# EAGLE design Newtech Music Board (EAGLE 9.6.2)

## Sheet 1 of 3
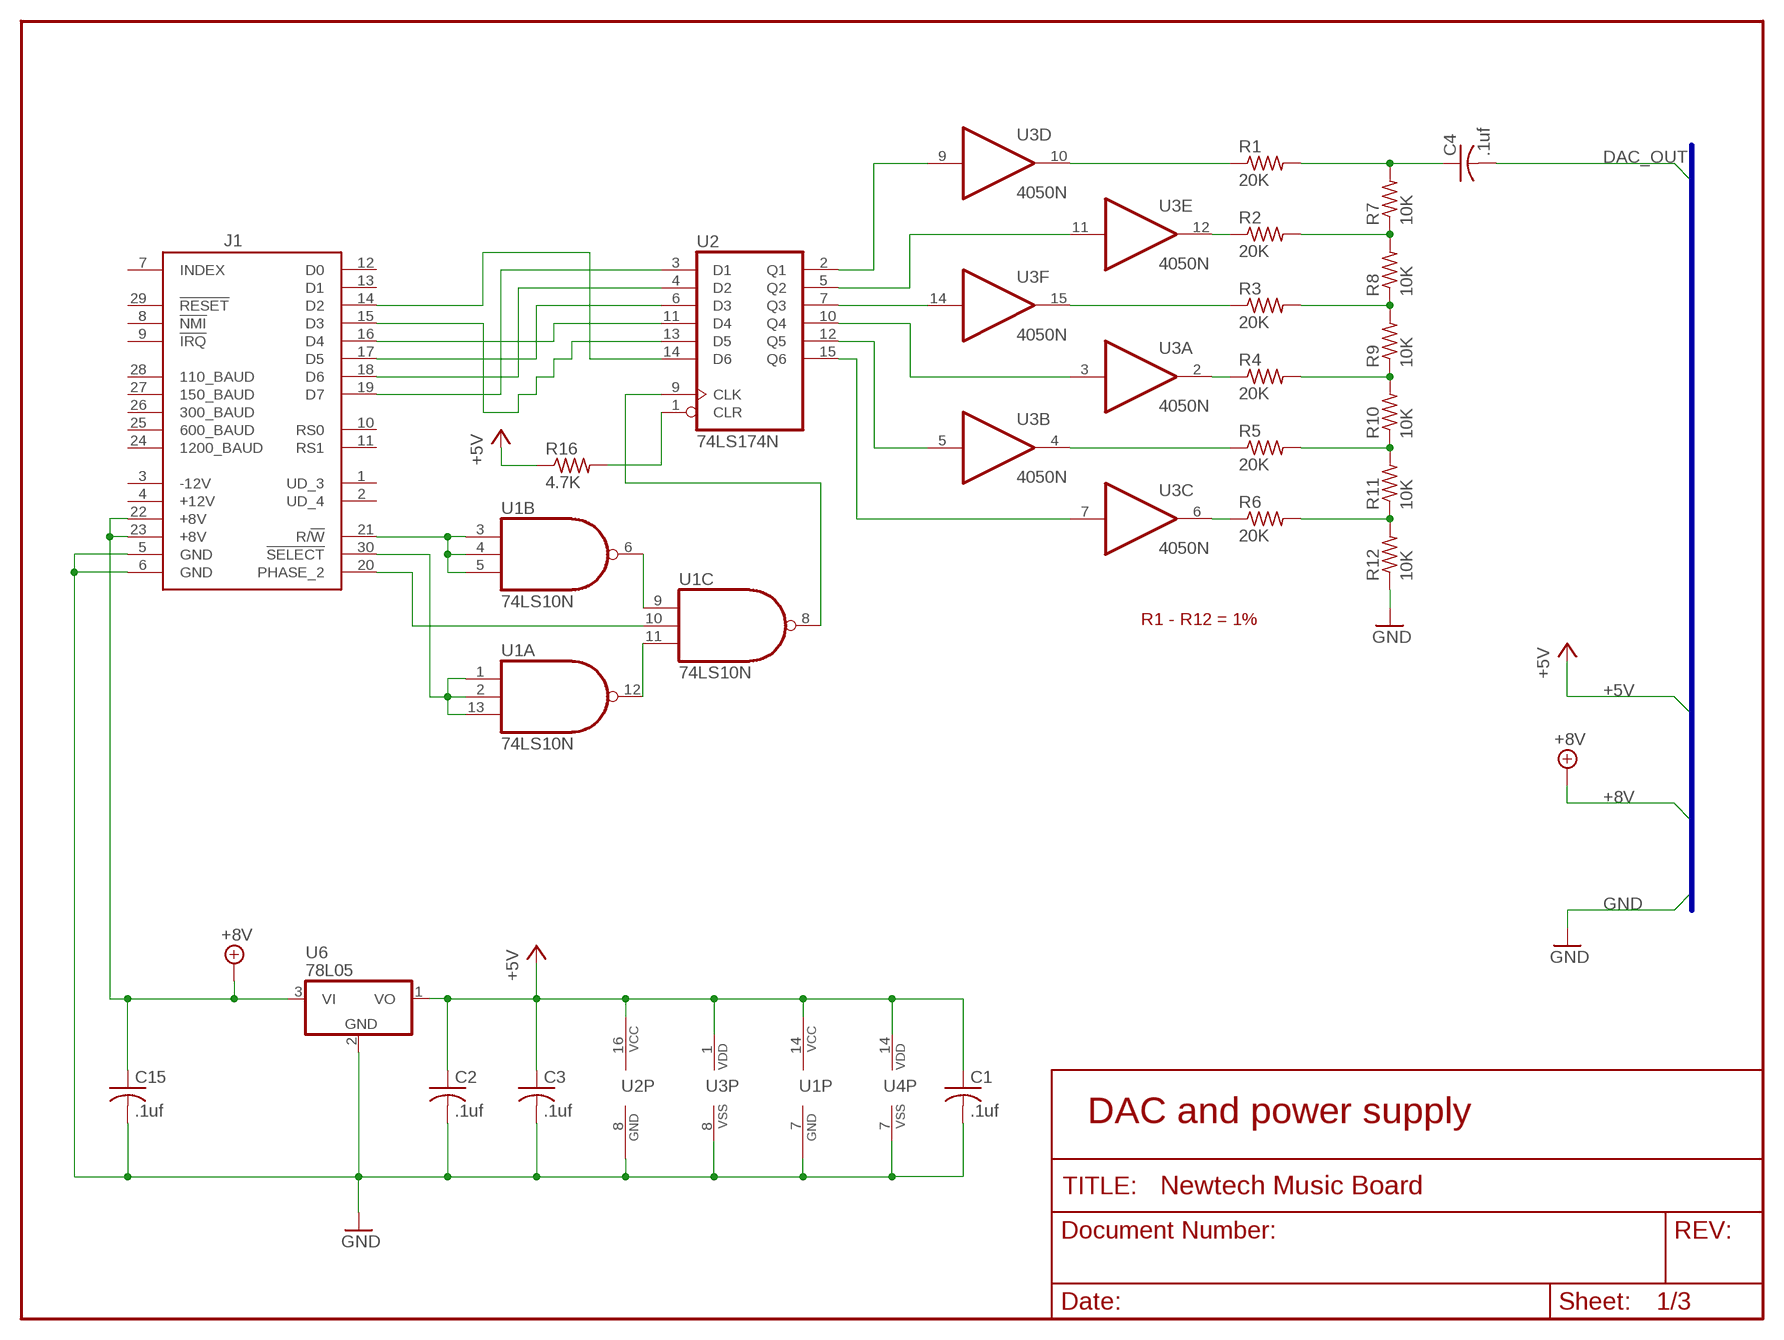
[diagram p0: schematic, sheet 1]

### Parts
C1  .1uf  C-US025-025X050  [C025-025X050]
C2  .1uf  C-US025-025X050  [C025-025X050]
C3  .1uf  C-US025-025X050  [C025-025X050]
C4  .1uf  C-US025-024X044  [C025-024X044]
C15  .1uf  C-US025-025X050  [C025-025X050]
J1  SS-30_BOARD_CONNECTOR  [SS-30_BOARD_CONNECTOR]
R1  20K  R-US_0204/7  [0204/7]
R2  20K  R-US_0204/7  [0204/7]
R3  20K  R-US_0204/7  [0204/7]
R4  20K  R-US_0204/7  [0204/7]
R5  20K  R-US_0204/7  [0204/7]
R6  20K  R-US_0204/7  [0204/7]
R7  10K  R-US_0204/7  [0204/7]
R8  10K  R-US_0204/7  [0204/7]
R9  10K  R-US_0204/7  [0204/7]
R10  10K  R-US_0204/7  [0204/7]
R11  10K  R-US_0204/7  [0204/7]
R12  10K  R-US_0204/7  [0204/7]
R16  4.7K  R-US_0204/7  [0204/7]
U1  74LS10N  [DIL14]
U2  74LS174N  [DIL16]
U3  4050N  [DIL16]
U4  4069N  [DIL14]
U6  78L05  78L05ACZ  [TO-92]

### Nets
!SELECT: J1.30(!SELECT) U1.1(A:I0) U1.2(A:I1) U1.13(A:I2)
+5V: C1.1 C2.1 C3.1 R16.1 U1.14(P:VCC) U2.16(VCC) U3.1(P:VDD) U4.14(P:VDD) U6.1(VO) ; also sheet 3
+8V [POWER]: C15.1 J1.22(+8V) J1.23(+8V) U6.3(VI) ; also sheet 3
DAC_OUT: C4.2 ; also sheet 2
GND [POWER]: C1.2 C2.2 C3.2 C15.2 J1.5(GND) J1.6(GND) R12.1 U1.7(P:GND) U2.8(GND) U3.8(P:VSS) U4.7(P:VSS) U6.2(GND) ; also sheet 3
N$1: J1.19(D7) U2.3(D1)
N$2: J1.18(D6) U2.4(D2)
N$3: J1.17(D5) U2.6(D3)
N$4: U1.6(B:O) U1.9(C:I0)
N$5: U1.11(C:I2) U1.12(A:O)
N$6: J1.16(D4) U2.11(D4)
N$7: J1.15(D3) U2.13(D5)
N$8: J1.14(D2) U2.14(D6)
N$9: U2.2(Q1) U3.9(D:I)
N$10: U2.5(Q2) U3.11(E:I)
N$11: U2.7(Q3) U3.14(F:I)
N$12: U2.10(Q4) U3.3(A:I)
N$13: U2.12(Q5) U3.5(B:I)
N$14: U2.15(Q6) U3.7(C:I)
N$16: U1.8(C:O) U2.9(CLK)
N$17: R16.2 U2.1(CLR)
N$18: R1.1 U3.10(D:O)
N$19: R2.1 U3.12(E:O)
N$20: R3.1 U3.15(F:O)
N$21: R4.1 U3.2(A:O)
N$22: R5.1 U3.4(B:O)
N$23: R6.1 U3.6(C:O)
N$24: R2.2 R7.1 R8.2
N$25: R3.2 R8.1 R9.2
N$26: R4.2 R9.1 R10.2
N$27: R5.2 R10.1 R11.2
N$28: R6.2 R11.1 R12.2
N$29: C4.1 R1.2 R7.2
PHASE2: J1.20(PHASE_2) U1.10(C:I1)
R/!W: J1.21(R/!W) U1.3(B:I0) U1.4(B:I1) U1.5(B:I2)
Unconnected: J1.1(UD_3) J1.2(UD_4) J1.7(INDEX) J1.8(!NMI) J1.9(!IRQ) J1.10(RS0) J1.11(RS1) J1.12(D0) J1.13(D1) J1.24(1200_BAUD) J1.25(600_BAUD) J1.26(300_BAUD) J1.27(150_BAUD) J1.28(110_BAUD) J1.29(!RESET)

### Buses
+5V,+8V,GND,DAC_OUT,LPF_OUT

### Notes on the sheet
- R1 - R12 = 1%
- DAC and power supply

## Sheet 2 of 3
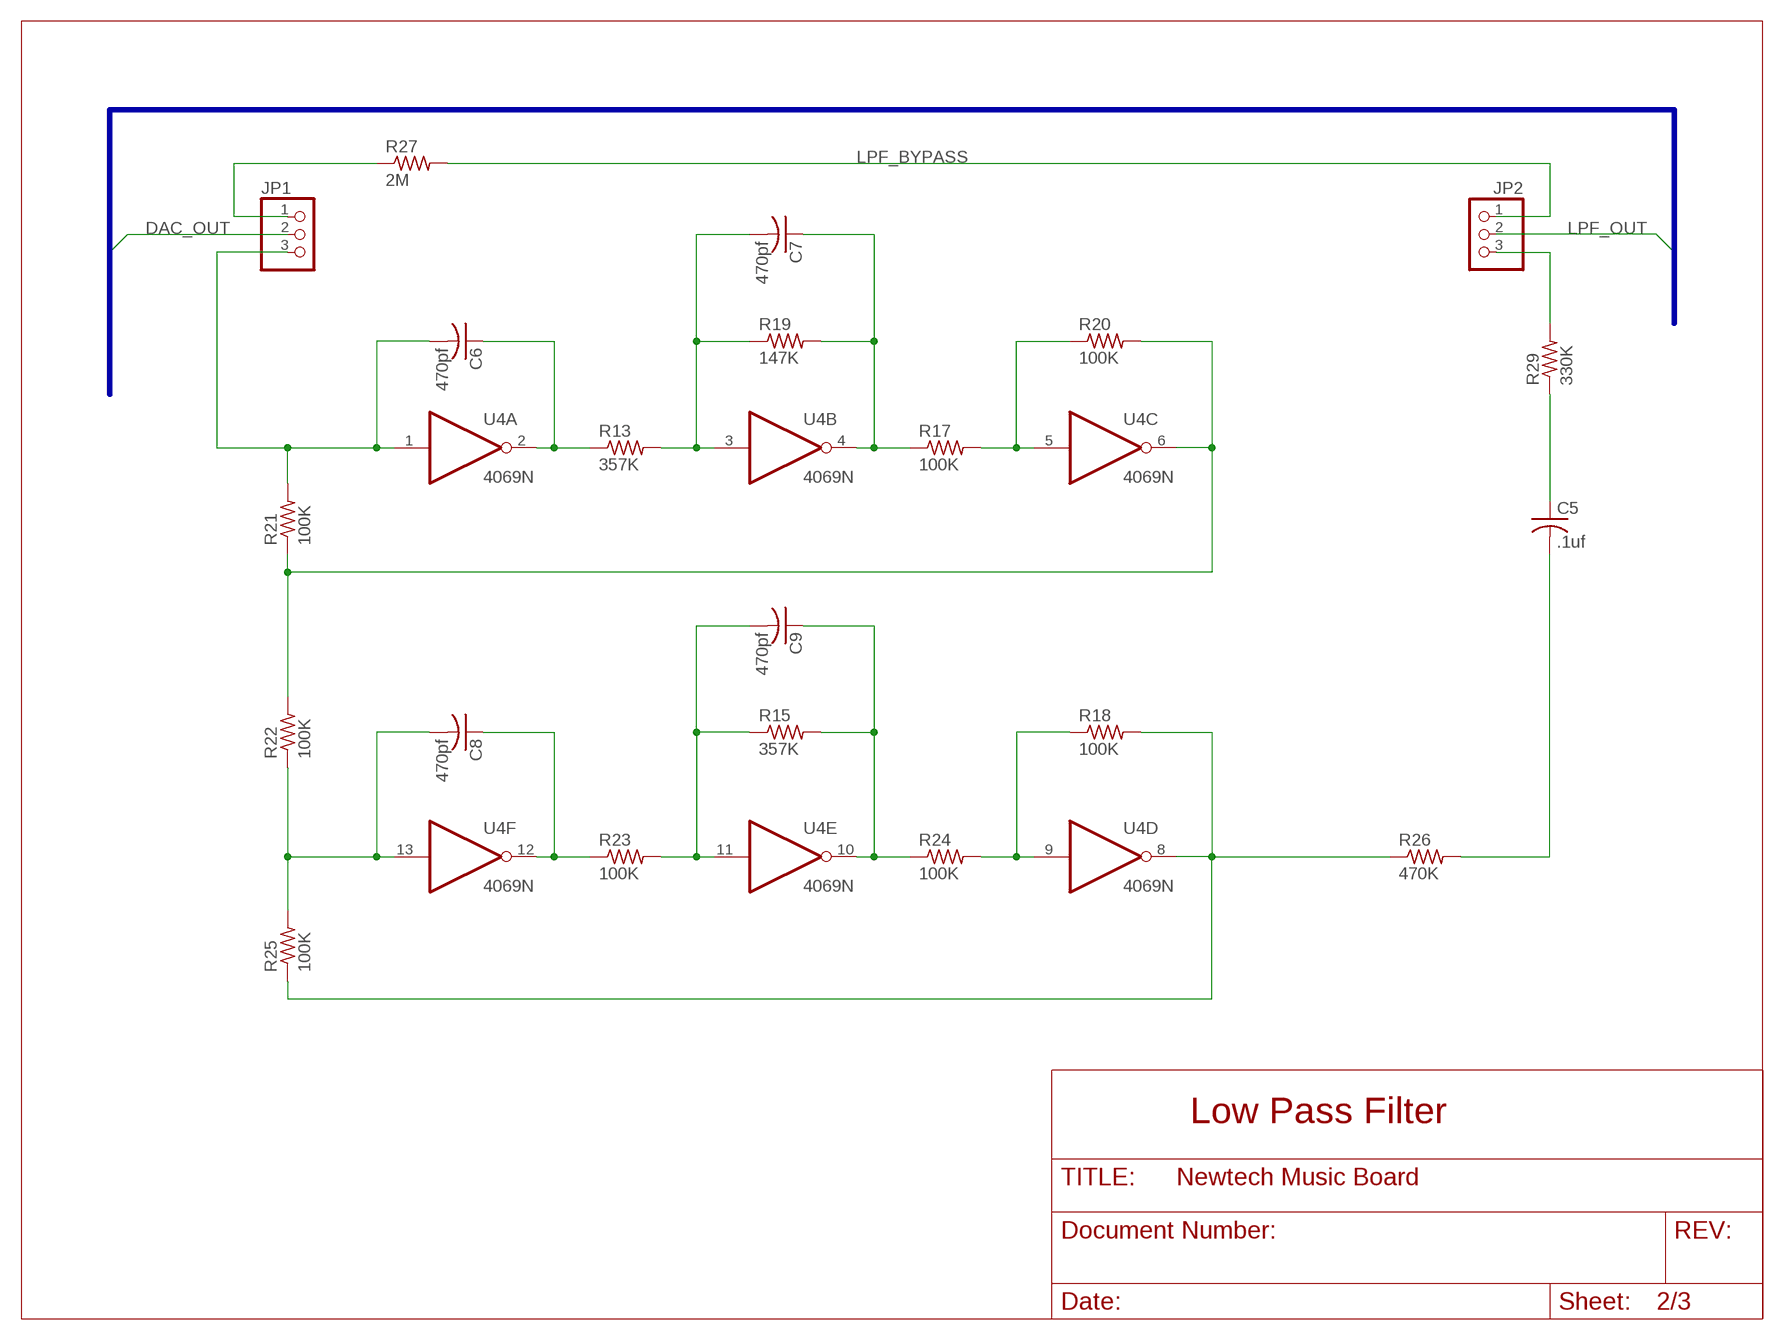
[diagram p1: schematic, sheet 2]

### Parts
C5  .1uf  C-US025-025X050  [C025-025X050]
C6  470pf  C-US050-045X075  [C050-045X075]
C7  470pf  C-US050-045X075  [C050-045X075]
C8  470pf  C-US050-045X075  [C050-045X075]
C9  470pf  C-US050-045X075  [C050-045X075]
JP1  PINHD-1X3  [1X03]
JP2  PINHD-1X3  [1X03]
R13  357K  R-US_0204/7  [0204/7]
R15  357K  R-US_0204/7  [0204/7]
R17  100K  R-US_0204/7  [0204/7]
R18  100K  R-US_0204/7  [0204/7]
R19  147K  R-US_0204/7  [0204/7]
R20  100K  R-US_0204/7  [0204/7]
R21  100K  R-US_0204/7  [0204/7]
R22  100K  R-US_0204/7  [0204/7]
R23  100K  R-US_0204/7  [0204/7]
R24  100K  R-US_0204/7  [0204/7]
R25  100K  R-US_0204/7  [0204/7]
R26  470K  R-US_0204/7  [0204/7]
R27  2M  R-US_0204/7  [0204/7]
R29  330K  R-US_0204/7  [0204/7]

### Nets
DAC_OUT: JP1.2 ; also sheet 1
LPF_BYPASS: JP2.1 R27.2
LPF_OUT: JP2.2 ; also sheet 3
N$31: C6.2 JP1.3 R21.2 U4.1(A:I)
N$32: JP2.3 R29.2
N$33: C6.1 R13.1 U4.2(A:O)
N$34: C7.2 R13.2 R19.1 U4.3(B:I)
N$35: C7.1 R17.1 R19.2 U4.4(B:O)
N$37: R17.2 R20.1 U4.5(C:I)
N$38: R20.2 R21.1 R22.2 U4.6(C:O)
N$39: JP1.1 R27.1
N$40: C8.1 R23.1 U4.12(F:O)
N$41: C9.2 R15.1 R23.2 U4.11(E:I)
N$42: C9.1 R15.2 R24.1 U4.10(E:O)
N$43: R18.1 R24.2 U4.9(D:I)
N$45: R18.2 R25.1 R26.1 U4.8(D:O)
N$49: C5.2 R26.2
N$51: C5.1 R29.1
N$56: C8.2 R22.1 R25.2 U4.13(F:I)

### Buses
+5V,+8V,GND,DAC_OUT,LPF_OUT

### Notes on the sheet
- Low Pass Filter

## Sheet 3 of 3
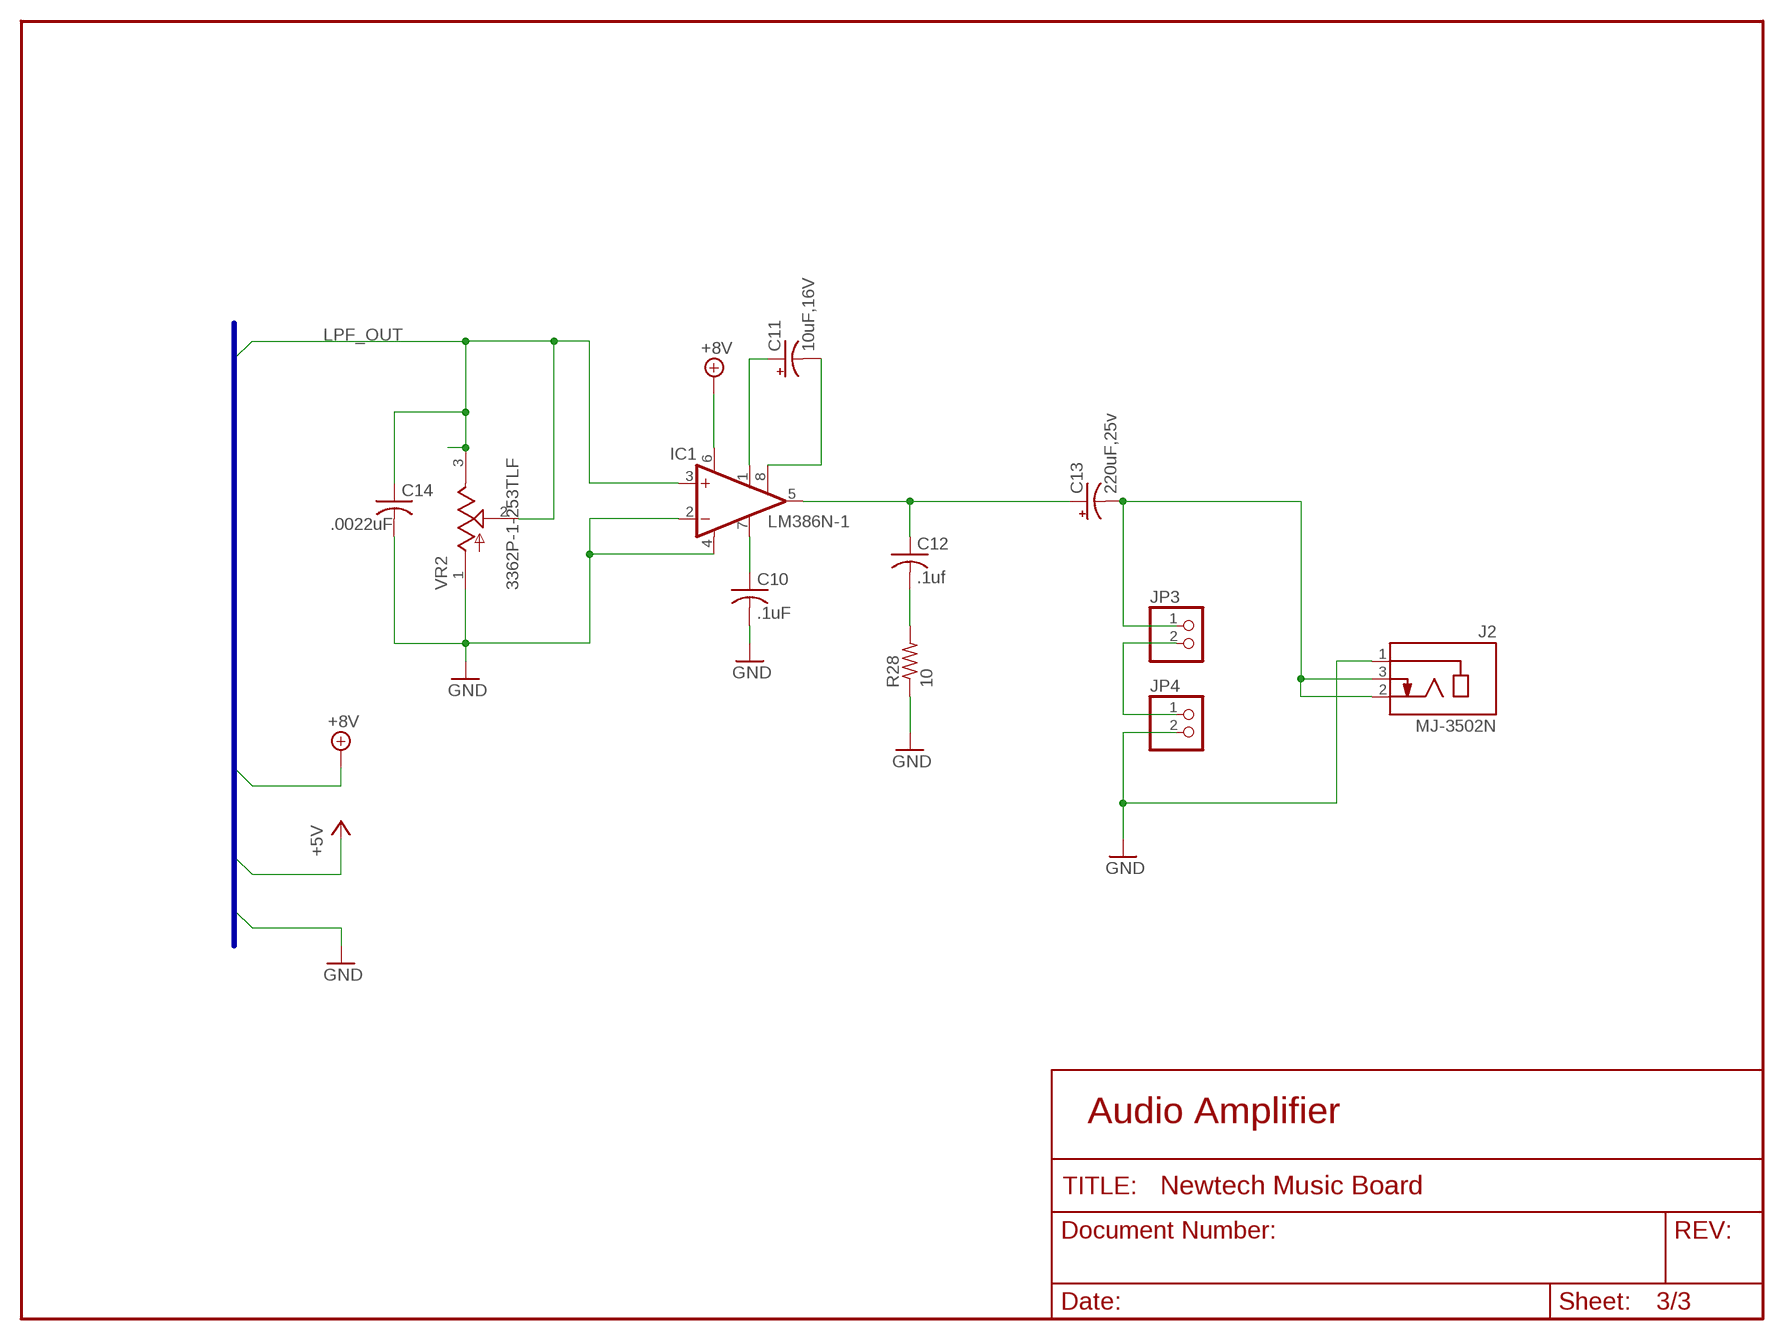
[diagram p2: schematic, sheet 3]

### Parts
C10  .1uF  C-US025-025X050  [C025-025X050]
C11  10uF,16V  CPOL-USE2.5-6  [E2,5-6]
C12  .1uf  C-US025-025X050  [C025-025X050]
C13  220uF,25v  CPOL-USE25-9AXIAL  [E25-9]
C14  .0022uF  C-US025-025X050  [C025-025X050]
IC1  LM386N-1  [DIL08]
J2  MJ-3502N  [CUI_MJ-3502N]
JP3  PINHD-1X2  [1X02]
JP4  PINHD-1X2  [1X02]
R28  10  R-US_0204/7  [0204/7]
VR2  3362P-1-253TLF  [TRIM_3362P-1-253TLF]

### Nets
+8V [POWER]: IC1.6(VS) ; also sheet 1
GND [POWER]: C10.2 C14.2 IC1.2(-IN) IC1.4(GND) J2.1 JP4.2 R28.1 VR2.1(CCW) ; also sheet 1
LPF_OUT: C14.1 IC1.3(+IN) VR2.2(WIPER) VR2.3(CW) ; also sheet 2
N$15 [Audio]: JP3.2 JP4.1
N$30: C10.1 IC1.7(BYPASS)
N$36: C12.2 R28.2
N$46: C11.+ IC1.1(GAIN)
N$47 [Audio]: C12.1 C13.+ IC1.5(OUT)
N$48 [Audio]: C13.- J2.2 J2.3 JP3.1
N$50: C11.- IC1.8(GAIN)

### Buses
+5V,+8V,GND,DAC_OUT,LPF_OUT

### Notes on the sheet
- Audio Amplifier

## Power pins joined to a net without a drawn wire
+12V: J1.4(+12V)
-12V: J1.3(-12V)

## Library data of the parts
C1-C9 C12 C14 C15 = rcl:C-US: CAPACITOR, American symbol
C10 = rcl:C-US: CAPACITOR, American symbol; SPICEPREFIX: C
C11 C13 = rcl:CPOL-US: POLARIZED CAPACITOR, American symbol; SPICEPREFIX: C
IC1 = linear:LM386?-*: Low Voltage Audio Power Amplifier Source: http://cache.national.com/ds/LM/LM386.pdf
J1 = Bob:SS-30_BOARD_CONNECTOR
J2 = MJ-3502N:MJ-3502N: 3.5 mm, Mono, Right Angle, Through Hole, Audio Jack Connector Check availability <https://pricing.snapeda.com/parts/MJ-3502N/CUI%20Devices/view-part?ref=eda>; AVAILABILITY: In Stock; CHECK_PRICES: https://www.snapeda.com/parts/MJ-3502N/CUI+Devices/view-part/?ref=eda; CUI_PURCHASE_URL: https://www.cuidevices.com/product/interconnect/connectors/audio-connectors/jacks/mj-3502n?utm_source=snapeda.com&utm_medium=referral&utm_campaign=snapedaBOM; DESCRIPTION: 3.5 mm, Mono, Right Angle, Through Hole, 2 Conductors, 1 Internal Switch, Audio Jack Connector; MF: CUI Devices; MP: MJ-3502N; PACKAGE: None; PRICE: None; PURCHASE-URL: https://www.snapeda.com/api/url_track_click_mouser/?unipart_id=542465&manufacturer=CUI Devices&part_name=MJ-3502N&search_term=audio 3.5 jack mono; SNAPEDA_LINK: https://www.snapeda.com/parts/MJ-3502N/CUI+Devices/view-part/?ref=snap
JP1 JP2 = pinhead:PINHD-1X3: PIN HEADER
JP3 JP4 = pinhead:PINHD-1X2: PIN HEADER
R1-R13 R15-R27 R29 = rcl:R-US_: RESISTOR, American symbol
R28 = rcl:R-US_: RESISTOR, American symbol; SPICEPREFIX: R
U1 = 74xx-us:74*10: Triple 3-input NAND gate
U2 = 74xx-us:74*174: Hex D type FLIP FLOP, clear
U3 = 40xx:4050: Hex non-inverting BUFFER
U4 = 40xx:4069: Hex INVERTER
U6 = 78L05ACZ:78L05ACZ: Check availability <https://pricing.snapeda.com/parts/78L05ACZ/STMicroelectronics/view-part?ref=eda>; AVAILABILITY: Not in stock; CHECK_PRICES: https://www.snapeda.com/parts/78L05ACZ/STMicroelectronics/view-part/?ref=eda; DESCRIPTION: Linear Voltage Regulator IC Positive Fixed 1 Output 100mA TO-92-3; MF: STMicroelectronics; MP: 78L05ACZ; PACKAGE: TO-92 STMicroelectronics; PRICE: None; SNAPEDA_LINK: https://www.snapeda.com/parts/78L05ACZ/STMicroelectronics/view-part/?ref=snap
VR2 = 3362P-1-253TLF:3362P-1-253TLF: Res Cermet Trimmer 50K Ohm 10% 1/2W 1(Elec)/1(Mech)Turn 2.77mm (6.6 X 6.99 X 4.7mm) Pin Thru-Hole Tube; MF: Bourns; MP: 3362P-1-205LF; PARTREV: 08/26/10; STANDARD: Manufacturer Recommendation

## Net classes
1 POWER: width 0.406 mm
2 Audio: width 0.762 mm

## Board
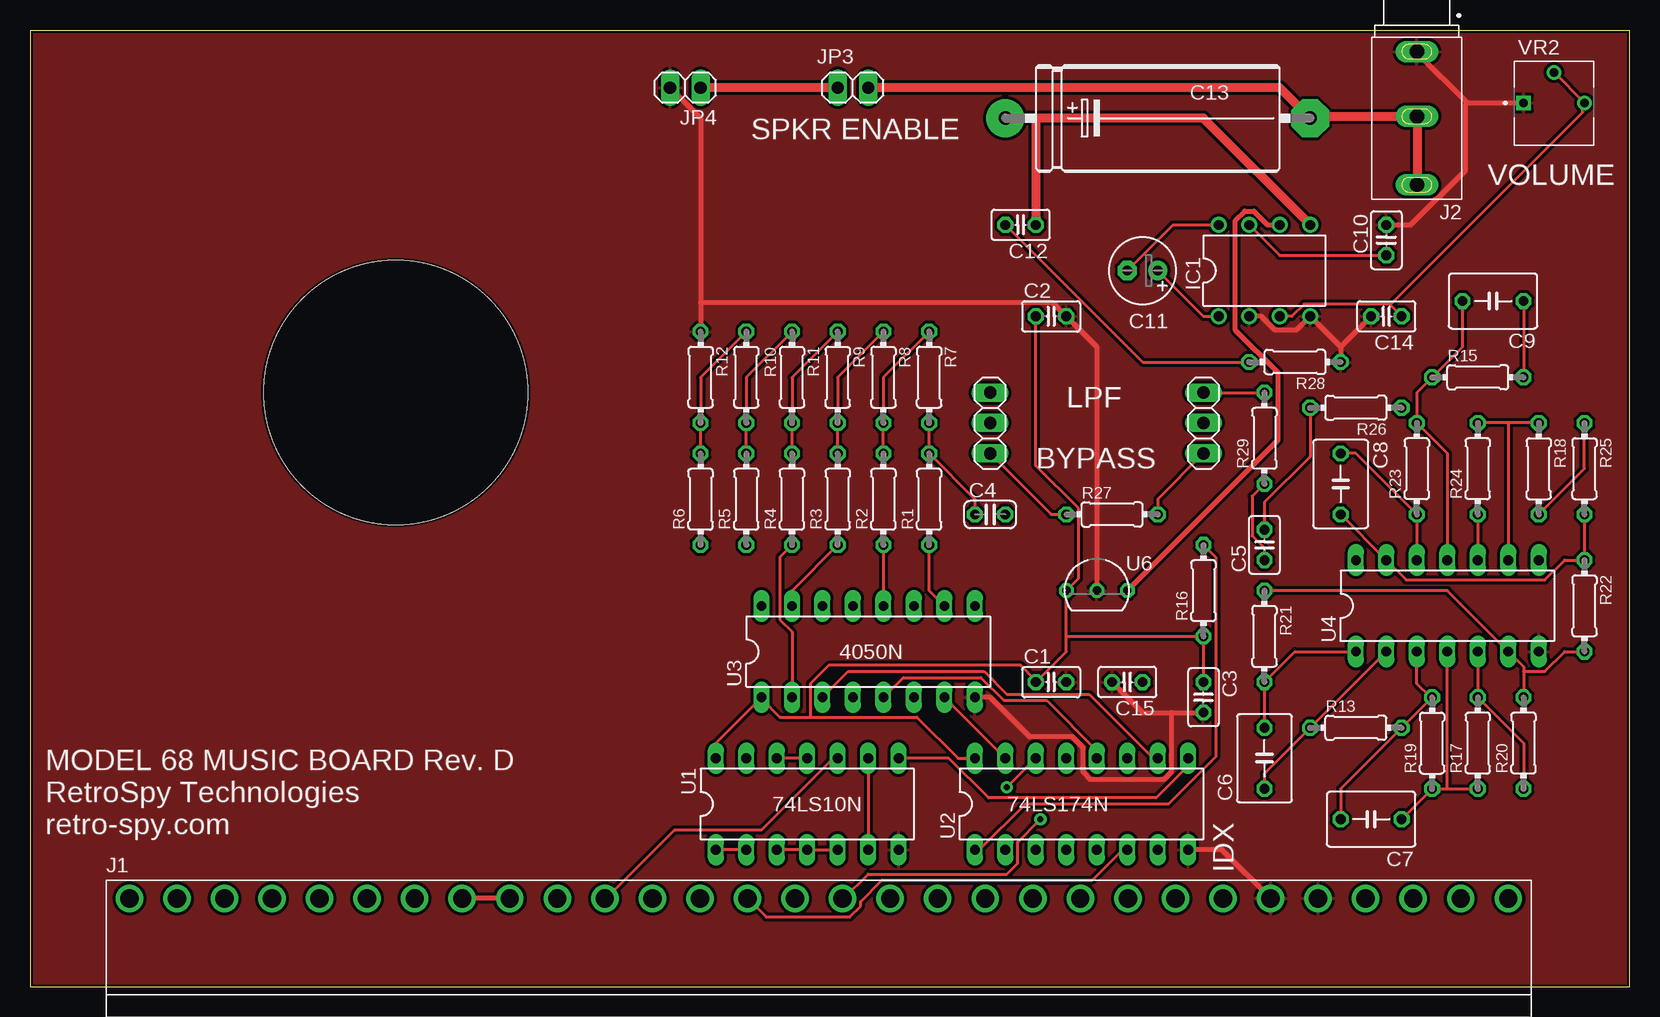
[diagram p3: board, top side]
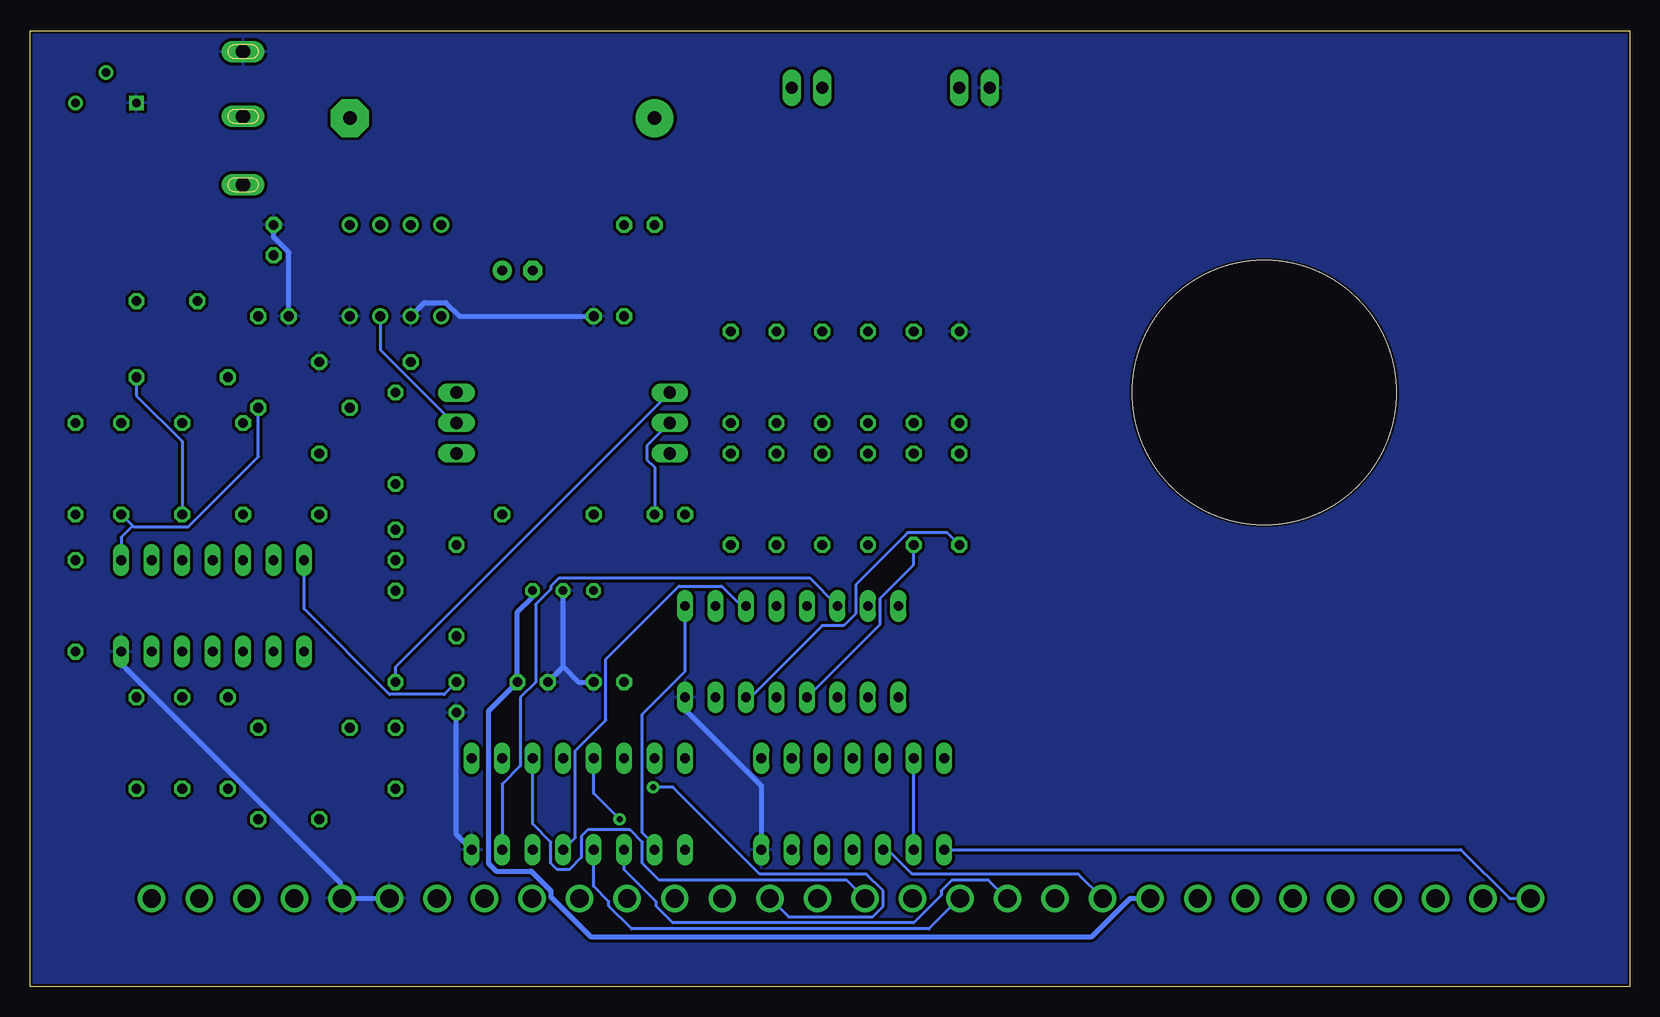
[diagram p4: board, bottom side, seen from below]

Size 133.33 x 79.68 mm. Coordinates in mm from the lower left corner, seen from the top.
Outline: 0,0 133.33,0 133.33,79.68 0,79.68 0,0
Copper layers (1*16): Top 0.035mm / dielectric 1.5mm / Bottom 0.035mm
Design rules "RetroSpy-2-layer-STANDARD": minimum track width 10mil, minimum drill 20mil, track to track 10mil, track to pad 8mil, pad to pad 8mil, via to via 10mil, smd to smd 8mil, copper to edge 8mil, drill to drill 8mil, minimum pad ring 10mil, minimum via ring 10mil, stop-mask expansion 4mil, vias tented up to drill 25mil, thermal gap 10mil
Holes 22 mm at 30.48,49.53

### Footprints (pad centres in the part's own frame; a part is rotated, then mirrored left to right if it is on the bottom)
C025-025X050 = drill 0.813 octagon: 1 -1.27,0; 2 1.27,0
C025-024X044 = drill 0.813 octagon: 1 -1.27,0; 2 1.27,0
C050-045X075 = drill 0.813 octagon: 1 -2.54,0; 2 2.54,0
E2,5-6 = drill 0.813 pad 1.6: + -1.27,0 | drill 0.813 pad 1.6 octagon: - 1.27,0
E25-9 = drill 1.118 pad 3.15: + -12.7,0 | drill 1.118 pad 3.15 octagon: - 12.7,0
DIL08 = drill 0.813 pad 1.27: 1 -3.81,-3.81; 2 -1.27,-3.81; 3 1.27,-3.81; 4 3.81,-3.81; 5 3.81,3.81; 6 1.27,3.81; 7 -1.27,3.81; 8 -3.81,3.81
SS-30_BOARD_CONNECTOR = drill 1.524: 1 57.15,3.556; 2 53.188,3.556; 3 49.225,3.556; 4 45.263,3.556; 5 41.3,3.556; 6 37.338,3.556; 7 33.376,3.556; 8 29.413,3.556; 9 25.451,3.556; 10 21.488,3.556; 11 17.526,3.556; 12 13.564,3.556; 13 9.601,3.556; 14 5.639,3.556; 15 1.676,3.556; 16 -2.286,3.556; 17 -6.248,3.556; 18 -10.211,3.556; 19 -14.173,3.556; 20 -18.136,3.556; 21 -22.098,3.556; 22 -26.06,3.556; 23 -30.023,3.556; 24 -33.985,3.556; 25 -37.948,3.556; 26 -41.91,3.556; 27 -45.872,3.556; 28 -49.835,3.556; 29 -53.797,3.556; 30 -57.76,3.556
CUI_MJ-3502N = drill 1.2 long: 1 -5.55,0; 2 -0.15,0; 3 5.55,0
1X03 = drill 1.016 long: 1 -2.54,0; 2 0,0; 3 2.54,0
1X02 = drill 1.016 long: 1 -1.27,0; 2 1.27,0
0204/7 = drill 0.813 octagon: 1 -3.81,0; 2 3.81,0
DIL14 = drill 0.813 long: 1 -7.62,-3.81; 2 -5.08,-3.81; 3 -2.54,-3.81; 4 0,-3.81; 5 2.54,-3.81; 6 5.08,-3.81; 7 7.62,-3.81; 8 7.62,3.81; 9 5.08,3.81; 10 2.54,3.81; 11 0,3.81; 12 -2.54,3.81; 13 -5.08,3.81; 14 -7.62,3.81
DIL16 = drill 0.813 long: 1 -8.89,-3.81; 2 -6.35,-3.81; 3 -3.81,-3.81; 4 -1.27,-3.81; 5 1.27,-3.81; 6 3.81,-3.81; 7 6.35,-3.81; 8 8.89,-3.81; 9 8.89,3.81; 10 6.35,3.81; 11 3.81,3.81; 12 1.27,3.81; 13 -1.27,3.81; 14 -3.81,3.81; 15 -6.35,3.81; 16 -8.89,3.81
TO-92 = drill 0.7 octagon: 1 -2.54,0; 2 0,0; 3 2.54,0
TRIM_3362P-1-253TLF = drill 0.714 square: 1 -2.54,0 | drill 0.714: 2 0,2.54; 3 2.54,0

### Placement (x,y rotation side)
C1  85.09,25.4 0 top
C2  85.09,55.88 0 top
C3  97.79,24.13 270 top
C4  80.01,39.37 0 top
C5  102.87,36.83 90 top
C6  102.87,19.05 90 top
C7  111.76,13.97 180 top
C8  109.22,41.91 270 top
C9  121.92,57.15 180 top
C10  113.03,62.23 90 top
C11  92.71,59.69 180 top
C12  82.55,63.5 180 top
C13  93.98,72.39 0 top
C14  113.03,55.88 180 top
C15  91.44,25.4 180 top
IC1  102.87,59.69 0 top
J1  66.04,3.81 0 top
J2  115.57,72.39 270 top
JP1  80.01,46.99 90 top
JP2  97.79,46.99 90 top
JP3  68.58,74.93 180 top
JP4  54.61,74.93 180 top
R1  74.93,40.64 90 top
R2  71.12,40.64 90 top
R3  67.31,40.64 90 top
R4  63.5,40.64 90 top
R5  59.69,40.64 90 top
R6  55.88,40.64 90 top
R7  74.93,50.8 270 top
R8  71.12,50.8 270 top
R9  67.31,50.8 270 top
R10  63.5,50.8 270 top
R11  59.69,50.8 270 top
R12  55.88,50.8 270 top
R13  110.49,21.59 0 top
R15  120.65,50.8 0 top
R16  97.79,33.02 90 top
R17  120.65,20.32 90 top
R18  125.73,43.18 270 top
R19  116.84,20.32 270 top
R20  124.46,20.32 90 top
R21  102.87,29.21 270 top
R22  129.54,31.75 270 top
R23  115.57,43.18 90 top
R24  120.65,43.18 90 top
R25  129.54,43.18 270 top
R26  110.49,48.26 180 top
R27  90.17,39.37 0 top
R28  105.41,52.07 180 top
R29  102.87,45.72 90 top
U1  64.77,15.24 0 top
U2  87.63,15.24 0 top
U3  69.85,27.94 0 top
U4  118.11,31.75 0 top
U6  88.9,33.02 0 top
VR2  127,73.66 0 top

### Tracks (layer width: path | path; a pad name or v marks a point on that pad's centre or on a via)
!SELECT
  Top 0.254: U1.2 U1.1
  Bottom 0.254: U1.2 U1.13 | J1.30 10.03,7.37 14.1,11.43 U1.1
+5V
  Top 0.254: U1.14 57.15,20.32 U3.1 60.96,24 62.48,22.48 65.02,22.48 | U2.16 77.34,19.05 73.91,22.48 65.02,22.48 | C3.1 R16.1 86.36,29.21 | 86.36,29.21 86.36,27.94 C1.1 83.82,25.53 82.55,26.8 66.55,26.8 65.02,25.27 65.02,22.48 | 86.36,29.21 U6.1 87.38,34.04 87.38,39.88 83.82,43.43 C2.1
  Bottom 0.254: U4.14 110.49,31.5 103.38,24.38 98.81,24.38 C3.1
+8V
  Top 0.406: J1.22 J1.23 | IC1.6 103.12,63.5 101.98,64.64 101.22,64.64 100.46,63.88 100.46,54.74 104.01,51.18 104.01,45.59 U6.3
  Bottom 0.406: U6.3 91.44,32.51 92.71,31.24 C15.1 95.12,22.99 95.12,10.29 94.49,9.65 91.57,9.65 89.92,8 89.92,7.49 86.61,4.19 44.83,4.19 41.66,7.37 J1.22
DAC_OUT
  Bottom 0.254: C4.2 81.28,43.31 81.92,43.94 81.92,45.09 JP1.2
GND
  Top 0.406: 95.12,22.86 92.71,22.86 C15.2 | 95.12,22.86 C3.2 | U3.8 80.01,24.13 83.31,20.83 86.87,20.83 87.76,19.94 87.76,17.91 88.39,17.27 94.49,17.27 95.12,17.91 95.12,22.86 | U2.8 99.31,11.43 J1.6 | 55.88,57.02 55.88,72.39 JP4.2 | 55.88,57.02 R12.1 | 119.76,73.66 VR2.1 | 119.76,73.66 115.57,77.85 J2.1 | 109.22,53.34 R28.1 | 109.22,53.34 IC1.4 105.54,54.74 103.76,54.74 102.62,55.88 IC1.2 | 109.22,53.34 C14.2 | C10.2 115.06,63.5 119.63,68.07 119.63,73.53 119.76,73.66 | 55.88,57.02 85.22,57.02 C2.2 88.9,53.34 U6.2
  Bottom 0.406: U1.7 72.39,16.76 78.74,23.11 U3.8 | 88.9,26.67 U6.2 | C15.2 88.9,26.67 | C1.2 87.63,25.4 88.9,26.67 | U4.7 125.73,26.92 107.44,8.64 107.44,7.37 J1.5 J1.6 | C3.2 97.79,12.7 U2.8 | C2.2 97.54,55.88 98.68,57.02 100.46,57.02 IC1.2 | C10.2 113.03,62.48 111.76,61.21 C14.2
  pour Top: 0,81.28 133.35,81.28 133.35,0 0,0
  pour Bottom: 0,81.28 133.35,81.28 133.35,0 0,0
LPF_BYPASS
  Top 0.254: R27.2 93.98,40.64 JP2.1
LPF_OUT
  Top 0.254: VR2.2 VR2.3 129.41,73.66 129.41,72.9 113.35,56.83 | IC1.3 105.16,55.88 106.17,56.9 113.28,56.9 113.35,56.83 | C14.1 113.35,56.83
  Bottom 0.254: JP2.2 98.04,46.99 104.14,53.09 IC1.3
N$1
  Bottom 0.254: U2.3 83.82,9.78 81.15,7.11 81.15,6.73 79.76,5.33 59.69,5.33 57.4,7.62 57.4,8 56.52,8.89 53.47,8.89 51.94,7.37 J1.19
N$2
  Bottom 0.254: U2.4 86.36,8.38 85.09,7.11 85.09,6.73 83.19,4.83 58.42,4.83 55.88,7.37 J1.18
N$3
  Top 0.254: U2.6 91.06,11.43 88.52,8.89 70.99,8.89 69.22,7.11 69.22,6.73 68.33,5.84 61.34,5.84 59.82,7.37 J1.17
N$4
  Top 0.254: U1.9 U1.6
N$5
  Top 0.254: U1.11 U1.12
N$6
  Bottom 0.254: U2.11 91.44,13.59 89.92,12.06 89.92,10.29 89.41,9.78 88.39,9.78 87.38,10.79 87.38,12.57 86.87,13.08 83.31,13.08 82.3,12.06 82.3,10.29 80.9,8.89 65.28,8.89 J1.16
N$7  (via drill 0.51)
  Top 0.254: v84.2,13.97 82.3,12.06 82.3,10.29 81.41,9.4 69.85,9.4 67.82,7.37 J1.15
  Bottom 0.254: U2.13 86.36,16.13 v84.2,13.97
N$8  (via drill 0.51)
  Top 0.254: v81.41,16.64 U2.14
  Bottom 0.254: v81.41,16.64 79.76,16.64 72.52,9.4 63.63,9.4 62.23,8 62.23,6.73 63.12,5.84 70.1,5.84 71.63,7.37 J1.14
N$9
  Bottom 0.254: U3.9 78.74,26.29 82.3,22.73 82.3,12.83 81.28,11.81 U2.2
N$10
  Bottom 0.254: U3.11 74.04,31.75 75.69,33.4 79.25,33.4 85.34,27.3 85.34,22.23 87.88,19.68 87.88,12.45 U2.5
N$11
  Bottom 0.254: U2.7 93.98,16.89 92.46,18.41 92.46,24.13 91.19,25.4 91.19,31.88 89.92,33.15 89.92,33.4 89.28,34.04 68.33,34.04 U3.14
N$12
  Top 0.254: U2.10 93.6,19.05 88.27,24.38 81.41,24.38 79.5,26.29 68.2,26.29 U3.3
N$13
  Top 0.254: U2.12 88.9,19.68 84.71,23.88 81.15,23.88 79.25,25.78 72.77,25.78 U3.5
N$14
  Top 0.254: U3.7 U2.15
N$15
  Top 0.762: JP3.2 JP4.1
N$16
  Top 0.254: U1.8 76.58,19.05 79.88,15.75 93.85,15.75 96.52,18.41 U2.9
N$17
  Top 0.254: U2.1 79.12,11.43 82.93,15.24 94.87,15.24 98.81,19.18 98.81,35.81 R16.2
N$18
  Top 0.254: R1.1 74.93,33.02 U3.10
N$19
  Top 0.254: R2.1 U3.12
N$20
  Top 0.254: U3.15 63.5,33.02 R3.1
N$21
  Top 0.254: U3.2 63.5,29.59 62.48,30.61 62.48,35.81 R4.1
N$22
  Bottom 0.254: R5.1 59.69,35.18 62.48,32.38 62.48,30.23 U3.4
N$23
  Bottom 0.254: U3.6 73.28,24.13 67.31,30.1 65.53,30.1 64.52,31.11 64.52,33.53 60.2,37.85 56.9,37.85 R6.1
N$24
  Top 0.254: R2.2 R8.2 71.12,50.8 R7.1
N$25
  Top 0.254: R3.2 R9.2 67.31,50.8 R8.1
N$26
  Top 0.254: R4.2 R10.2 63.5,50.8 R9.1
N$27
  Top 0.254: R5.2 R11.2 59.69,50.8 R10.1
N$28
  Top 0.254: R6.2 R12.2 55.88,50.8 R11.1
N$29
  Top 0.254: R7.2 R1.2 78.74,40.64 C4.1
N$30
  Top 0.254: C10.1 104.14,60.96 IC1.7
N$31
  Top 0.254: C6.2 R21.2 105.41,27.94 U4.1
  Bottom 0.254: JP1.3 102.87,26.67 R21.2
N$32
  Top 0.254: JP2.3 R29.2
N$33
  Top 0.254: C6.1 102.87,17.78 R13.1 U4.2
N$34
  Top 0.254: C7.2 109.22,16.51 R13.2 R19.1 116.71,24.13 115.57,25.27 U4.3
N$35
  Top 0.254: C7.1 R19.2 118.11,16.51 | 118.11,16.51 R17.1 | 118.11,16.51 U4.4
N$36
  Top 0.254: R28.2 92.71,52.07 C12.2
N$37
  Top 0.254: U4.5 R17.2 124.46,20.32 R20.1
N$38
  Top 0.254: 124.46,26.29 124.46,26.67 U4.6 118.11,33.02 R21.1 | 124.46,26.29 R20.2 | R22.2 127.89,27.94 126.24,26.29 124.46,26.29
N$39
  Top 0.254: R27.1 85.09,39.37 JP1.1
N$40
  Top 0.254: C8.1 110.49,44.45 R23.1 U4.12
N$41
  Top 0.254: U4.11 118.11,44.45 R23.2 115.57,49.53 R15.1 119.38,53.34 C9.2
N$42
  Top 0.254: R24.1 U4.10 | C9.1 R15.2
  Bottom 0.254: R24.1 120.65,45.47 124.46,49.28 R15.2
N$43
  Top 0.254: R18.1 123.19,46.99 | 123.19,46.99 R24.2 | 123.19,46.99 U4.9
N$45
  Top 0.254: R25.1 129.54,43.18 R18.2
  Bottom 0.254: R26.1 114.3,44.2 120.14,38.35 124.71,38.35 124.78,38.42 | R18.2 124.78,38.42 | U4.8 125.73,37.47 124.78,38.42
N$46
  Top 0.254: IC1.1 97.79,55.88 C11.+
N$47
  Top 0.762: IC1.5 97.79,72.39 83.82,72.39 | 83.82,72.39 C13.+ | 83.82,72.39 C12.1
N$48
  Top 0.762: JP3.1 104.14,74.93 C13.- 106.83,72.54 J2.2 115.62,72.24 115.62,66.85 J2.3
N$49
  Top 0.254: C5.2 102.87,40.39 106.68,44.2 R26.2
N$50
  Top 0.254: IC1.8 95.25,63.5 C11.-
N$51
  Top 0.254: C5.1 102.87,36.58 101.85,37.59 101.85,40.89 R29.1
N$56
  Top 0.254: R25.2 R22.1 127.89,35.56 126.24,33.91 114.68,33.91 U4.13 C8.2
PHASE2
  Top 0.254: U1.10 66.93,19.05 60.96,13.08 53.72,13.08 48.01,7.37 J1.20
R/!W
  Top 0.254: U1.3 U1.4 U1.5
  Bottom 0.254: U1.3 61.85,11.43 59.82,9.4 45.97,9.4 J1.21

### Text on the board
tNames: SPKR ENABLE | VOLUME | LPF | BYPASS | MODEL 68 MUSIC BOARD Rev. D / RetroSpy Technologies / retro-spy.com | IDX